# EAGLE design Exp_Board_Printrboard_v0.1 (EAGLE 6.4)
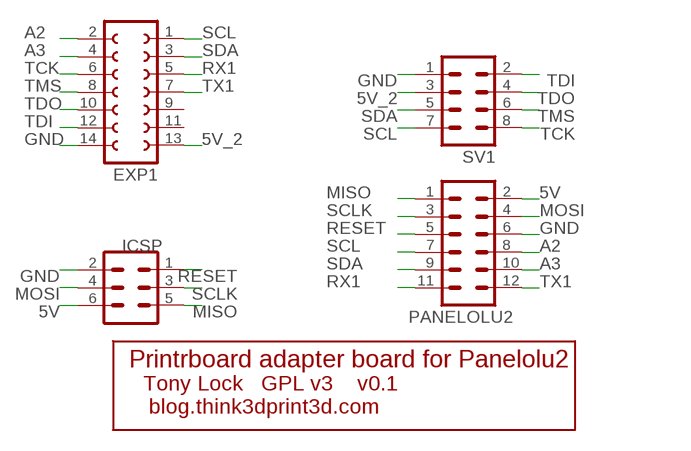
[diagram p0: schematic, sheet 1]

## Parts
EXP1  FE07-2  [FE07-2]
ICSP  MA03-2  [MA03-2]
PANELOLU2  MA06-2_BACK  [MA06-2_BACK]
SV1  MA04-2  [MA04-2]

## Nets
5V: ICSP.6 PANELOLU2.2
5V_2: EXP1.13 SV1.3
A2: EXP1.2 PANELOLU2.8
A3: EXP1.4 PANELOLU2.10
GND: EXP1.14 ICSP.2 PANELOLU2.6 SV1.1
MISO: ICSP.5 PANELOLU2.1
MOSI: ICSP.4 PANELOLU2.4
RESET: ICSP.1 PANELOLU2.5
RX1: EXP1.5 PANELOLU2.11
SCL: EXP1.1 PANELOLU2.7 SV1.7
SCLK: ICSP.3 PANELOLU2.3
SDA: EXP1.3 PANELOLU2.9 SV1.5
TCK: EXP1.6 SV1.8
TDI: EXP1.12 SV1.2
TDO: EXP1.10 SV1.4
TMS: EXP1.8 SV1.6
TX1: EXP1.7 PANELOLU2.12
Unconnected: EXP1.9 EXP1.11

## Notes on the sheet
- Printrboard adapter board for Panelolu2
- Tony Lock   GPL v3    v0.1
- blog.think3dprint3d.com

## Library data of the parts
EXP1 = con-lsta:FE07-2: FEMALE HEADER; OC_FARNELL: unknown; OC_NEWARK: unknown
ICSP = con-lstb:MA03-2: PIN HEADER; OC_FARNELL: unknown; OC_NEWARK: unknown
PANELOLU2 = con-lstb:MA06-2_BACK: PIN HEADER; OC_FARNELL: unknown; OC_NEWARK: unknown
SV1 = con-lstb:MA04-2: PIN HEADER; OC_FARNELL: unknown; OC_NEWARK: unknown

## Net classes
0 default: clearance 0.355 mm

## Board
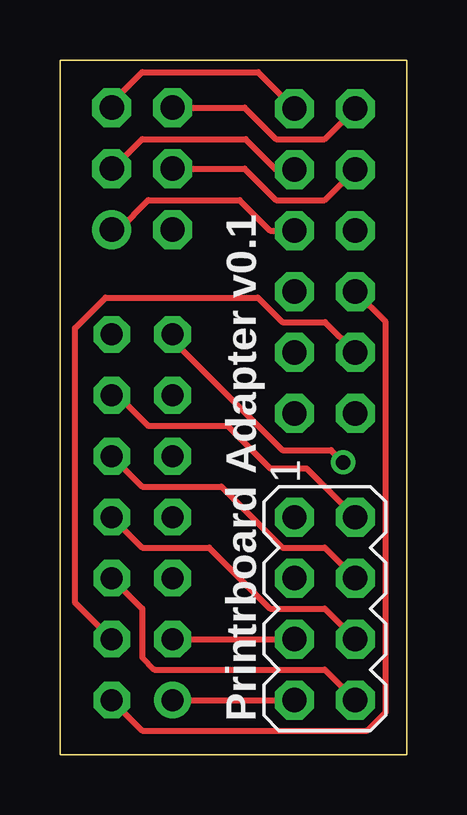
[diagram p1: board, top side]
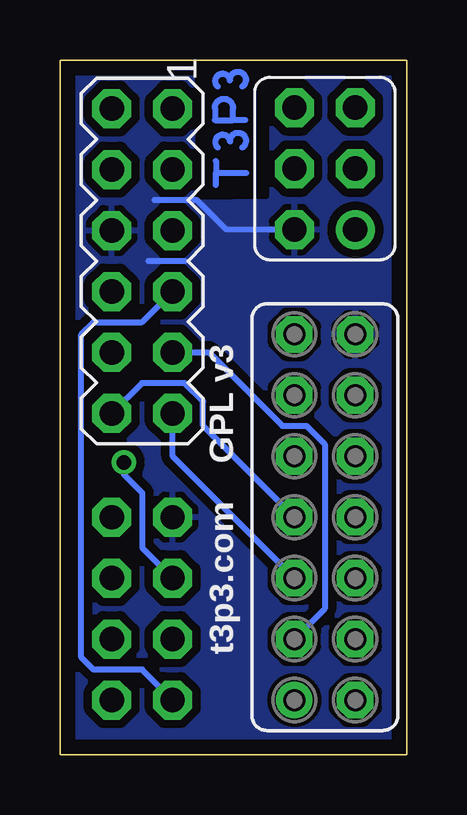
[diagram p2: board, bottom side, seen from below]

Size 14.48 x 28.96 mm. Coordinates in mm from the lower left corner, seen from the top.
Outline: 0,28.96 14.48,28.96 14.48,0 0,0 0,28.96
Copper layers (1*16): Top 0.035mm / dielectric 1.5mm / Bottom 0.035mm
Design rules "default *": minimum track width 10mil, minimum drill 24mil, track to track 10mil, track to pad 10mil, pad to pad 10mil, via to via 10mil, smd to smd 8mil, copper to edge 24mil, drill to drill 8mil, minimum pad ring 12mil, minimum via ring 8mil, stop-mask expansion 4mil, vias tented up to drill 0mil, thermal gap 10mil

### Footprints (pad centres in the part's own frame; a part is rotated, then mirrored left to right if it is on the bottom)
FE07-2 = drill 0.914: 1 -7.62,1.27 | drill 0.914 octagon: 2 -7.62,-1.27; 3 -5.08,1.27; 4 -5.08,-1.27; 5 -2.54,1.27; 6 -2.54,-1.27; 7 0,1.27; 8 0,-1.27; 9 2.54,1.27; 10 2.54,-1.27; 11 5.08,1.27; 12 5.08,-1.27; 13 7.62,1.27; 14 7.62,-1.27
MA03-2 = drill 1.016: 1 -2.54,-1.27 | drill 1.016 octagon: 2 -2.54,1.27; 3 0,-1.27; 4 0,1.27; 5 2.54,-1.27; 6 2.54,1.27
MA06-2_BACK = drill 1.016 octagon: 1 -6.35,-1.27; 2 -6.35,1.27; 3 -3.81,-1.27; 4 -3.81,1.27; 5 -1.27,-1.27; 6 -1.27,1.27; 7 1.27,-1.27; 8 1.27,1.27; 9 3.81,-1.27; 10 3.81,1.27; 11 6.35,-1.27; 12 6.35,1.27
MA04-2 = drill 1.016 octagon: 1 -3.81,-1.27; 2 -3.81,1.27; 3 -1.27,-1.27; 4 -1.27,1.27; 5 1.27,-1.27; 6 1.27,1.27; 7 3.81,-1.27; 8 3.81,1.27

### Placement (x,y rotation side)
EXP1  3.43,9.91 90 bottom
ICSP  3.43,24.43 90 bottom
PANELOLU2  11.05,20.58 270 top
SV1  11.05,6.1 270 top

### Tracks (layer width: path | path; a pad name or v marks a point on that pad's centre or on a via)
5V
  Top 0.254: ICSP.6 7.7,26.97 9.02,25.65 11.04,25.65 PANELOLU2.2
5V_2  (via drill 0.6)
  Top 0.254: EXP1.13 4.7,17.27 9.27,12.7 11.3,12.7 v11.81,12.19
  Bottom 0.254: v11.81,12.19 11.81,11.68 11.05,10.92 11.05,8.64 SV1.3
A2
  Top 0.254: EXP1.2 3.43,1.02 12.83,1.02 13.59,1.78 13.59,18.04 PANELOLU2.8
A3
  Top 0.254: EXP1.4 0.64,6.35 0.64,17.78 1.91,19.05 8.25,19.05 9.27,18.03 11.05,18.03 PANELOLU2.10
GND
  Bottom 0.254: 9.27,20.57 10.79,20.57 | 10.54,23.11 8.76,23.11 7.54,21.89 ICSP.2
  pour Bottom (isolate 0.305): 0,0.02 14.48,-0.13 14.48,29.08 -0.01,28.98
MISO
  Top 0.254: ICSP.5 2.16,27.18 3.43,28.45 8.26,28.45 PANELOLU2.1
MOSI
  Top 0.254: ICSP.4 7.7,24.43 9.02,23.11 11.04,23.11 PANELOLU2.4
N$3
  cutout Bottom: 8.7,23.25 5.87,23.29 5.88,29.11 8.74,29.11 8.7,23.46
N$4
  Bottom 0.254: 7.97,23.74 7.97,24.25 | 7.97,24.76 7.97,24.25 | 7.97,24.25 6.7,24.25
N$5
  Bottom 0.254: 7.89,25.31 arc225 7.38,25.56 arc243 6.87,25.31
N$6
  Bottom 0.254: 6.75,26.45 7.25,26.45 | 7.25,26.45 8.02,26.45 8.02,26.96 arc180 7.26,26.96 7.25,26.45
N$7
  Bottom 0.254: 7.89,27.85 arc225 7.38,28.1 arc243 6.88,27.85
RESET
  Top 0.254: ICSP.1 2.46,21.89 3.68,23.11 7.49,23.11 8.76,21.84 PANELOLU2.5
RX1
  Bottom 0.254: EXP1.5 9.78,12.45 PANELOLU2.11
SCL
  Top 0.254: EXP1.1 SV1.7
  Bottom 0.254: SV1.7 11.05,3.56 13.08,3.56 13.59,4.06 13.59,17.53 13.08,18.03 11.05,18.03 PANELOLU2.7
SCLK
  Top 0.254: ICSP.3 2.21,24.43 3.43,25.65 7.75,25.65 9.02,24.38 PANELOLU2.3
SDA
  Top 0.254: EXP1.3 SV1.5
  Bottom 0.254: PANELOLU2.9 8.26,16.77 5.21,13.72 4.19,13.72 3.43,12.95 3.43,6.1 EXP1.3
TCK
  Top 0.254: EXP1.6 3.43,6.1 3.43,4.06 3.94,3.56 11.05,3.56 SV1.8
TDI
  Top 0.254: EXP1.12 2.41,14.99 3.68,13.72 6.99,13.72 8.76,11.94 10.29,11.94 SV1.2
TDO
  Top 0.254: EXP1.10 3.43,11.18 6.73,11.18 9.27,8.64 11.05,8.64 SV1.4
TMS
  Top 0.254: EXP1.8 3.43,8.64 6.22,8.64 8.76,6.1 11.05,6.1 SV1.6
TX1
  Bottom 0.254: EXP1.7 8.51,13.72 8.51,14.73 9.27,15.49 11.05,15.49 PANELOLU2.12

### Text on the board
tPlace: Printrboard Adapter v0.1
bPlace: t3p3.com GPL v3